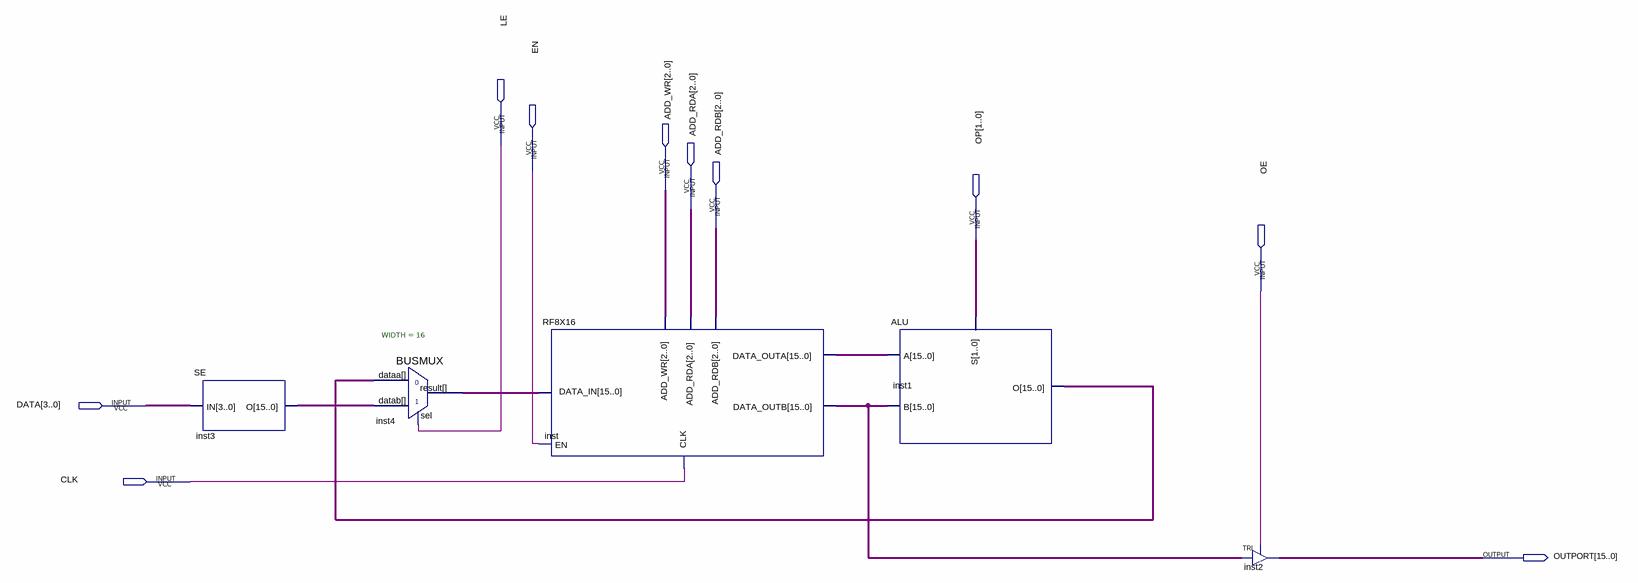
[diagram p0: schematic sheet]
// Quartus schematic DATAPATH.bdf as structural Verilog: 5 symbols, 10 pins
module DATAPATH (
  input  LE,
  input  EN,
  input  [2:0] ADD_WR,
  input  [2:0] ADD_RDA,
  input  [2:0] ADD_RDB,
  input  [1:0] OP,
  input  OE,
  input  [3:0] DATA,
  input  CLK,
  output [15:0] OUTPORT
);

  wire [15:0] inst1_o, inst3_o, inst4_result, inst_data_outa, inst_data_outb;

  SE inst3 (.IN(DATA), .O(inst3_o));
  BUSMUX #(.WIDTH(16)) inst4 (.datab(inst3_o), .sel(LE), .dataa(inst1_o), .result(inst4_result));
  RF8X16 inst (
    .DATA_IN(inst4_result), .ADD_RDA(ADD_RDA), .ADD_RDB(ADD_RDB), .EN(EN), .ADD_WR(ADD_WR), .CLK(CLK),
    .DATA_OUTA(inst_data_outa), .DATA_OUTB(inst_data_outb));
  ALU inst1 (.S(OP), .A(inst_data_outa), .B(inst_data_outb), .O(inst1_o));
  TRI inst2[15:0] (.IN(inst_data_outb), .OE(OE), .OUT(OUTPORT));
endmodule
